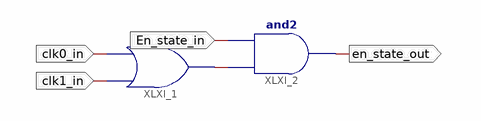
[diagram p0: schematic sheet 1]
// Xilinx ISE schematic yogi_st.sch (spartan3e) as structural Verilog: 2 symbols, 4 ports
module yogi_st (
  input  clk0_in,
  input  clk1_in,
  input  En_state_in,
  output en_state_out
);

  wire XLXN_3;

  or XLXI_1 (XLXN_3, clk1_in, clk0_in);
  and XLXI_2 (en_state_out, XLXN_3, En_state_in);
endmodule
